# Altium schematic sheet 200_UART_TO_USB.SchDoc: USART to USB
size A4; Organization: Altium Limited; Address1: L3, 12a Rodborough Rd; Address2: Frenchs Forest; Address3: NSW; Address4: Australia 2086; DocumentNumber: 4; SheetNumber: 4; SheetTotal: 6
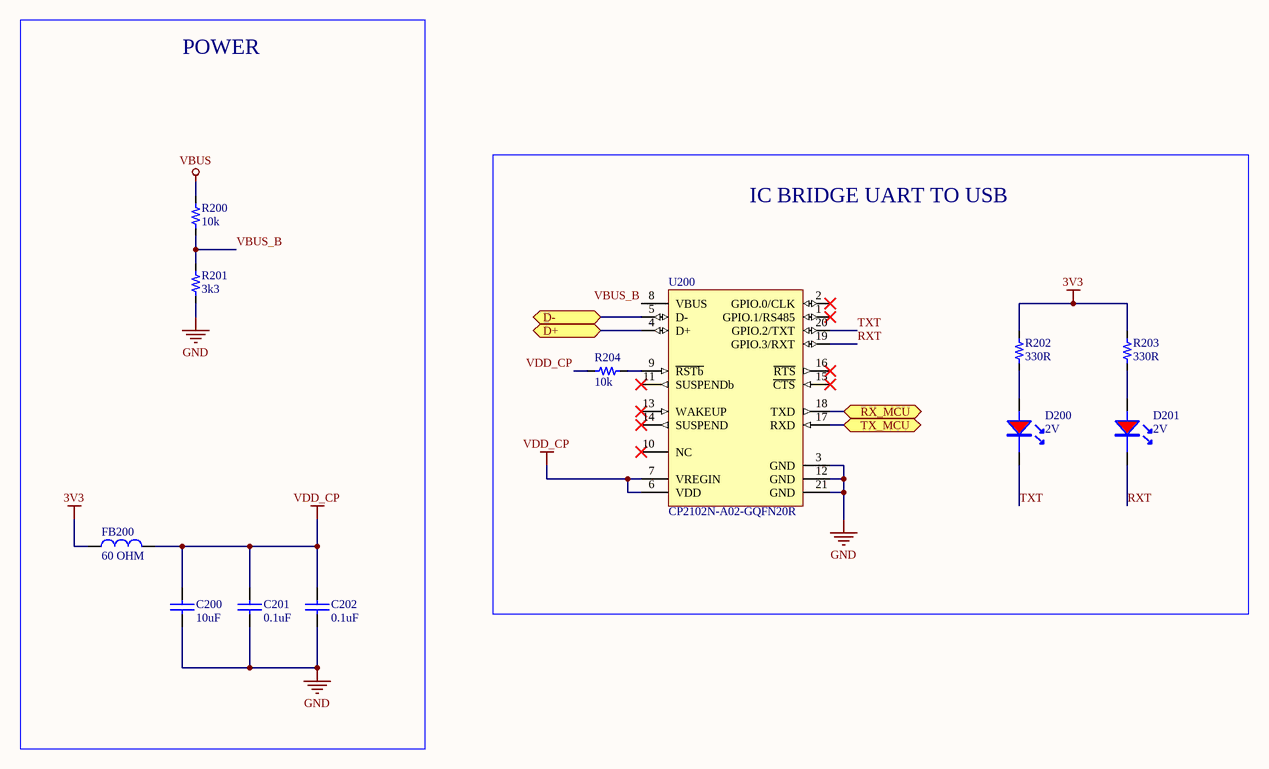
[diagram p0: 200_UART_TO_USB.SchDoc]

## Parts
C200  value 10uF  [0603_cap]  (hidden comment: 10uF 10V)
C201  value 0.1uF  [0603_cap]  (hidden comment: 0.1uF 50V)
C202  value 0.1uF  [0603_cap]  (hidden comment: 0.1uF 50V)
D200  2V  [0805_LED]
D201  2V  [0805_LED]
FB200  value 60 OHM  [0603_fb]  (hidden comment: 60OHM 2A)
R200  value 10k  [0603_res]  (hidden comment: 10k 1/10W)
R201  value 3k3  [0603_res]  (hidden comment: 3k3 1/10W)
R202  value 330R  [0603_res]  (hidden comment: 330R 1/10W)
R203  value 330R  [0603_res]  (hidden comment: 330R 1/10W)
R204  value 10k  [0603_res]  (hidden comment: 10k 1/10W)
U200  CP2102N-A02-GQFN20R  [WFQFN_20_EP_3X3MM]

## Blocks framed on the sheet
POWER: C200-C202 FB200 R200 R201
IC BRIDGE UART TO USB: D200 D201 R202-R204 U200

## Ports
D+ (bidir, see MAIN[3A], 000_POWER_MODULE[1B]), D- (bidir, see MAIN[3A], 000_POWER_MODULE[1B]), RX_MCU (bidir, see MAIN[3B], 300_MCU[3B]), TX_MCU (bidir, see MAIN[3B], 300_MCU[3A])

## Nets
3V3: FB200.1 R202.2 R203.2
GND: C200.2 C201.2 C202.2 R201.1 U200.3(GND) U200.12(GND) U200.21(GND)
VBUS: R200.2
VDD_CP: C200.1 C201.1 C202.1 FB200.2 R204.1 U200.6(VDD) U200.7(VREGIN)
D+: U200.4(D+) ; port D+
D-: U200.5(D-) ; port D-
RX_MCU: U200.18(TXD) ; port RX_MCU
RXT: D201.2 U200.19(GPIO.3/RXT)
TX_MCU: U200.17(RXD) ; port TX_MCU
TXT: D200.2 U200.20(GPIO.2/TXT)
VBUS_B: R200.1 R201.2 U200.8(VBUS)
NetD200_1: D200.1(A) R202.1
NetD201_1: D201.1(A) R203.1
NetR204_2: R204.2 U200.9(~{RSTb})

Not connected (* = marked no-connect by the designer): U200 1(GPIO.1/RS485)* 2(GPIO.0/CLK)* 10(NC)* 11(SUSPENDb)* 13(WAKEUP)* 14(SUSPEND)* 15(~{CTS})* 16(~{RTS})*

## Notes on the sheet
- Title
- Size:
- Date:
- A4
- Number:
- Time:
- Revision:
- Sheet
- of
- File:

## Library data of the parts
C200 = Cap_10uF_0603_10V: 10V 10uF X5R ±10% 0603 Multilayer Ceramic Capacitors MLCC - SMD/SMT ROHS; Manufacturer: CCTC; Manufacturer Part Number: TCC0603X5R106K100CT; Supplier 1: LCSC; Supplier Part Number 1: C380314; ComponentLink1Description: LCSC; ComponentLink1URL: https://www.lcsc.com/product-detail/Multilayer-Ceramic-Capacitors-MLCC-SMD-SMT_CCTC-TCC0603X5R106K100CT_C380314.html
C201 C202 = Cap_0.1uF_0603_50V: 50V 100nF Y5V -20%~+80% 0603 Multilayer Ceramic Capacitors MLCC - SMD/SMT ROHS; Manufacturer: Walsin Tech Corp; Manufacturer Part Number: 0603F104Z500CT; Supplier 1: LCSC; Supplier Part Number 1: C83060; ComponentLink1Description: LCSC; ComponentLink1URL: https://www.lcsc.com/product-detail/Multilayer-Ceramic-Capacitors-MLCC-SMD-SMT_Walsin-Tech-Corp-0603F104Z500CT_C83060.html
D200 D201 = LED_0805_RED: LED RED CLEAR 0805 SMD; Manufacturer: XINGLIGHT; Manufacturer Part Number: XL-2012SURC; Supplier 1: LCSC; Supplier Part Number 1: C965812; ComponentLink1Description: LCSC; ComponentLink1URL: https://www.lcsc.com/product-detail/Light-Emitting-Diodes-LED_XINGLIGHT-XL-2012SURC_C965812.html
FB200 = FB_60_0603_2A: 2A 1 100mΩ 60Ω@100MHz ±25% 0603 Ferrite Beads ROHS; Manufacturer: TAI-TECH; Manufacturer Part Number: HCB1608KF-600T20; ComponentLink1Description: LCSC; ComponentLink1URL: https://www.lcsc.com/product-detail/Ferrite-Beads_TAI-TECH-HCB1608KF-600T20_C369516.html; Supplier 1: LCSC; Supplier Part Number 1: C369516
R200 R204 = Res_10k_0603_1/10W: RES SMD 10k OHM 5% 1/10W 0603; Manufacturer: FOJAN; Manufacturer Part Number: FRC0603J103TS; ComponentLink1URL: https://www.lcsc.com/product-detail/Chip-Resistor-Surface-Mount_FOJAN-FRC0603J103TS_C2930027.html; Supplier 1: LCSC; Supplier Part Number 1: C2930027; ComponentLink1Description: LCSC
R201 = Res_3k3_0603_1/10W: RES SMD 3k3 OHM 5% 1/10W 0603; Manufacturer: FOJAN; Manufacturer Part Number: FRC0603J332 TS; ComponentLink1URL: https://www.lcsc.com/product-detail/Chip-Resistor-Surface-Mount_FOJAN-FRC0603J332-TS_C2907140.html; Supplier 1: LCSC; Supplier Part Number 1: C2907140; ComponentLink1Description: LCSC
R202 R203 = Res_330R_0603_1/10W: RES SMD 330R OHM 5% 1/10W 0603; Manufacturer: FOJAN; Manufacturer Part Number: FRC0603J331 TS; ComponentLink1URL: https://www.lcsc.com/product-detail/Chip-Resistor-Surface-Mount_FOJAN-FRC0603J331-TS_C2907152.html; Supplier 1: LCSC; Supplier Part Number 1: C2907152; ComponentLink1Description: LCSC
U200 = IC_SGL_USB2UART-BRIDGE_20QFN: IC USB TO UART BRIDGE QFN20; Manufacturer: Silicon Labs; Manufacturer Part Number: CP2102N-A02-GQFN20R; Supplier 1: LCSC; Supplier Part Number 1: C969913; ComponentLink1Description: LCSC; ComponentLink1URL: https://www.lcsc.com/product-detail/USB-ICs_SILICON-LABS-CP2102N-A02-GQFN20R_C969913.html